# EAGLE schematic met (EAGLE 7.6.0)
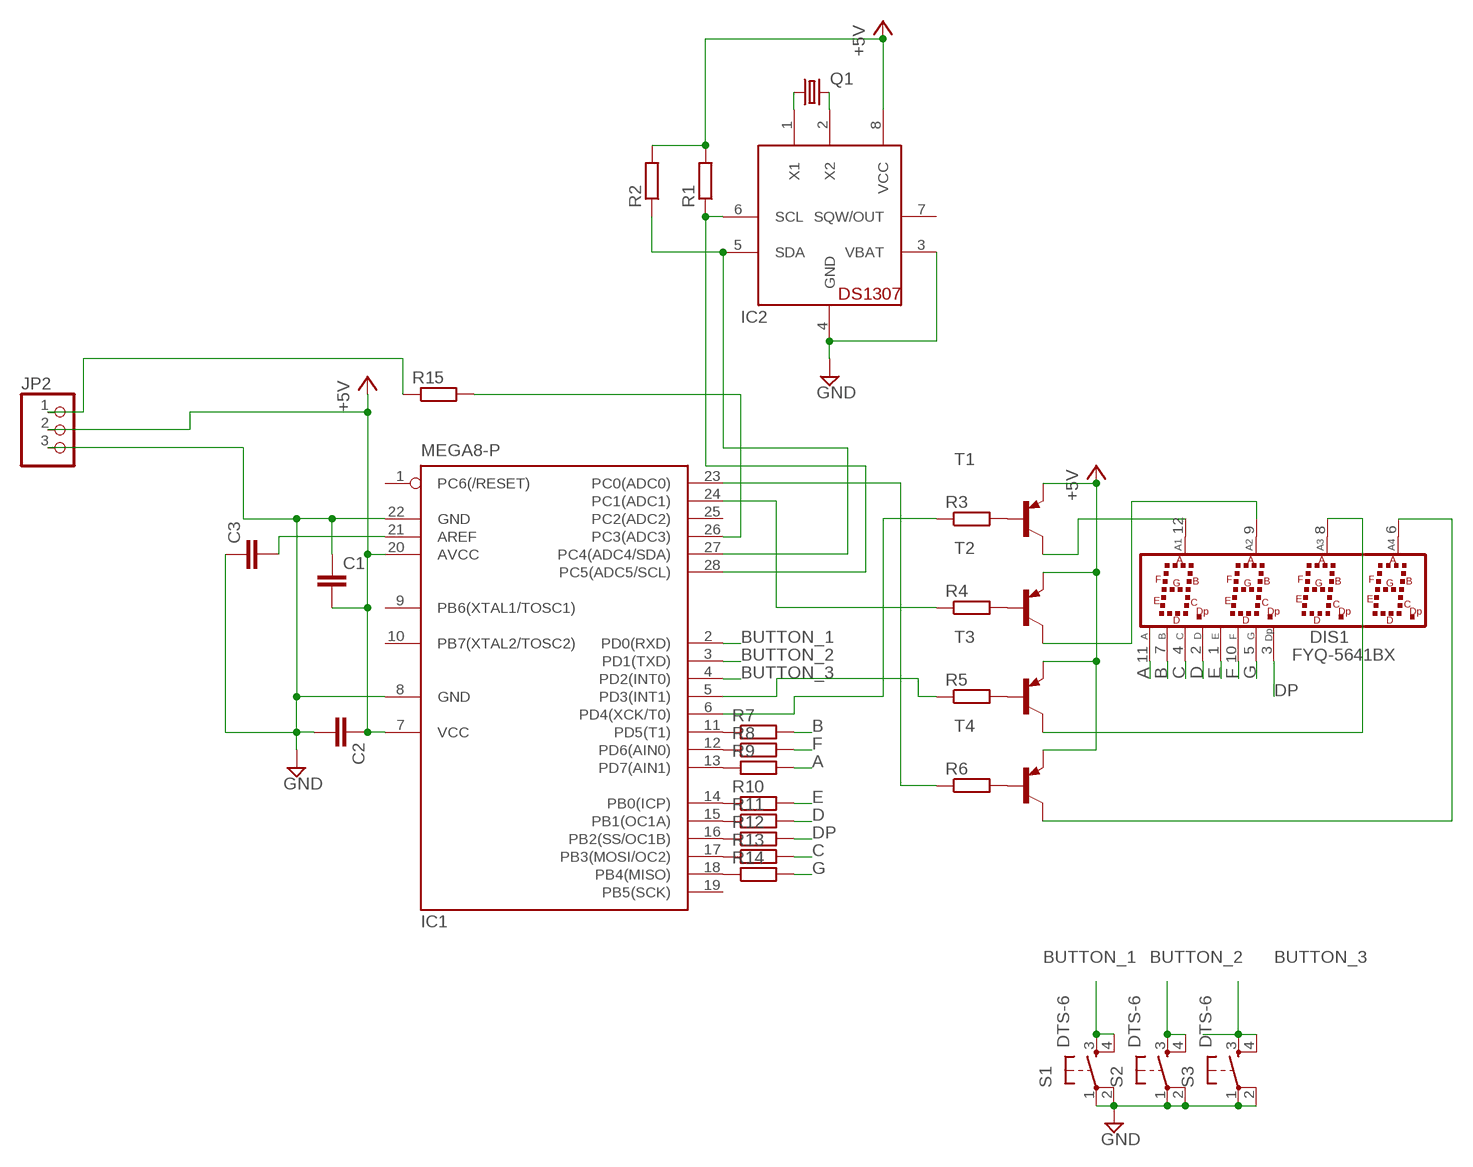
[diagram p0: schematic, sheet 1]

## Parts
C1  C-EU025-024X044  [C025-024X044]
C2  C-EU025-024X044  [C025-024X044]
C3  C-EU025-024X044  [C025-024X044]
DIS1  FYQ-5641BX  [FYQ5641]
IC1  MEGA8-P  [DIL28-3]
IC2  DS1307  [DIL08]
JP2  PINHD-1X3  [1X03]
Q1  CRYSTALTC26V  [TC26V]
R1  R-EU_0207/2V  [0207/2V]
R2  R-EU_0207/2V  [0207/2V]
R3  R-EU_0204/2V  [0204V]
R4  R-EU_0204/2V  [0204V]
R5  R-EU_0204/2V  [0204V]
R6  R-EU_0204/2V  [0204V]
R7  R-EU_0204/2V  [0204V]
R8  R-EU_0204/2V  [0204V]
R9  R-EU_0204/2V  [0204V]
R10  R-EU_0204/2V  [0204V]
R11  R-EU_0204/2V  [0204V]
R12  R-EU_0204/2V  [0204V]
R13  R-EU_0204/2V  [0204V]
R14  R-EU_0204/2V  [0204V]
R15  R-EU_0204/2V  [0204V]
S1  DTS-6  [DTS-6]
S2  DTS-6  [DTS-6]
S3  DTS-6  [DTS-6]
T1  BC327-PNP-TO92-EBC  [TO92-EBC]
T2  BC327-PNP-TO92-EBC  [TO92-EBC]
T3  BC327-PNP-TO92-EBC  [TO92-EBC]
T4  BC327-PNP-TO92-EBC  [TO92-EBC]

## Nets
+5V: C1.2 C2.1 IC1.7(VCC) IC1.20(AVCC) IC2.8(VCC) JP2.2 R1.2 R2.2 T1.E T2.E T3.E T4.E
A: DIS1.11(A) R9.2
B: DIS1.7(B) R7.2
BUTTON_1: IC1.2(PD0(RXD)) S1.3 S1.4
BUTTON_2: IC1.3(PD1(TXD)) S2.3 S2.4
BUTTON_3: IC1.4(PD2(INT0)) S3.3 S3.4
C: DIS1.4(C) R13.2
D: DIS1.2(D) R11.2
D2: DIS1.9(A2) T2.C
D3: DIS1.8(A3) T3.C
DOT: IC1.27(PC4(ADC4/SDA)) IC2.5(SDA) R2.1
DP: DIS1.3(DP) R12.2
E: DIS1.1(E) R10.2
F: DIS1.10(F) R8.2
G: DIS1.5(G) R14.2
GND: C1.1 C2.2 C3.1 IC1.8(GND) IC1.22(GND) IC2.3(VBAT) IC2.4(GND) JP2.3 S1.1 S1.2 S2.1 S2.2 S3.1 S3.2
N$1: IC2.1(X1) Q1.1
N$2: IC2.2(X2) Q1.2
N$3: C3.2 IC1.21(AREF)
N$4: JP2.1 R15.1
N$5: DIS1.6(A4) T4.C
N$6: IC1.28(PC5(ADC5/SCL)) IC2.6(SCL) R1.1
N$7: IC1.23(PC0(ADC0)) R6.1
N$8: IC1.6(PD4(XCK/T0)) R3.1
N$9: R5.2 T3.B
N$10: R3.2 T1.B
N$11: R4.2 T2.B
N$12: R6.2 T4.B
N$14: IC1.24(PC1(ADC1)) R4.1
N$15: IC1.5(PD3(INT1)) R5.1
N$16: IC1.11(PD5(T1)) R7.1
N$17: IC1.12(PD6(AIN0)) R8.1
N$18: IC1.13(PD7(AIN1)) R9.1
N$19: IC1.14(PB0(ICP)) R10.1
N$20: IC1.15(PB1(OC1A)) R11.1
N$21: IC1.16(PB2(SS/OC1B)) R12.1
N$22: IC1.17(PB3(MOSI/OC2)) R13.1
N$23: DIS1.12(A1) T1.C
N$24: IC1.18(PB4(MISO)) R14.1
N$25: IC1.26(PC3(ADC3)) R15.2
Unconnected: IC1.1(PC6(/RESET)) IC1.9(PB6(XTAL1/TOSC1)) IC1.10(PB7(XTAL2/TOSC2)) IC1.19(PB5(SCK)) IC1.25(PC2(ADC2)) IC2.7(SQW/OUT)

## Library data of the parts
C1-C3 = rcl:C-EU: CAPACITOR, European symbol
DIS1 = LED 7seg:FYQ-5641BX
IC1 = atmel:MEGA8-P: MICROCONTROLLER 8 Kbytes FLASH, 1 kbytes SRAM, 512 bytes EEPROM, USART, 4-channel 10 bit ADC, 2-channel 8 bit ADC Pin compatible with Atmega48, ATMega88, ATMega168 Source: avr.lbr; OC_FARNELL: unknown; OC_NEWARK: unknown
IC2 = adafruit:DS1307: DS1307 Real time clock (RTC) with battery backup ability. Talk to it via i2c
JP2 = pinhead:PINHD-1X3: PIN HEADER
Q1 = adafruit:CRYSTAL: CRYSTAL; OC_FARNELL: unknown; OC_NEWARK: unknown
R1-R15 = rcl:R-EU_: RESISTOR, European symbol
S1-S3 = switch-tact:DTS-6
T1-T4 = transistor:*-PNP-: PNP Transistror